# EAGLE design socket-v1 (EAGLE 6.2)
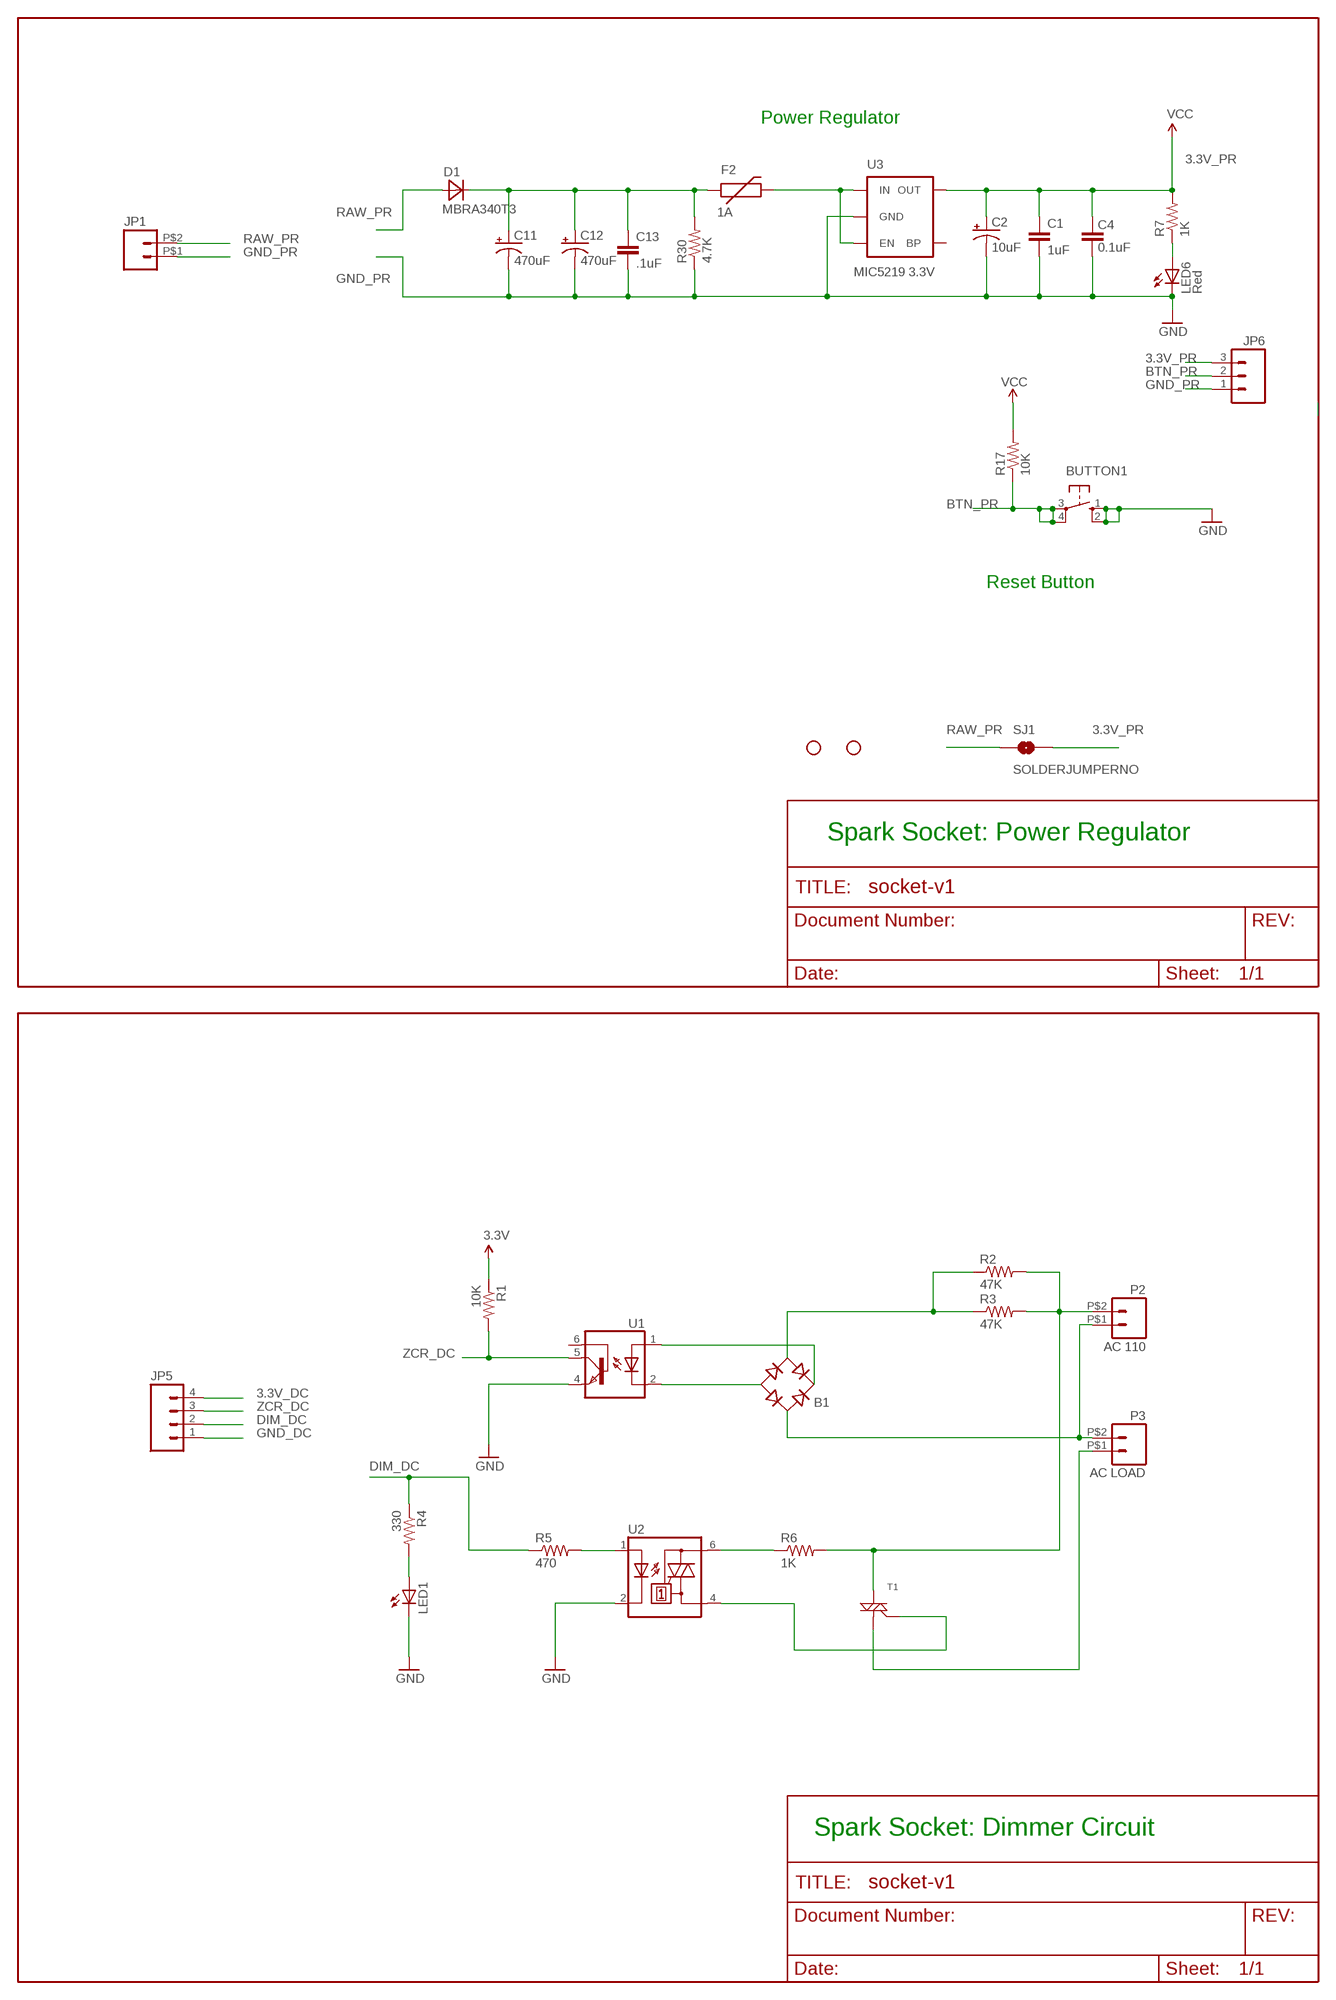
[diagram p0: schematic, sheet 1, part 1 of 2]
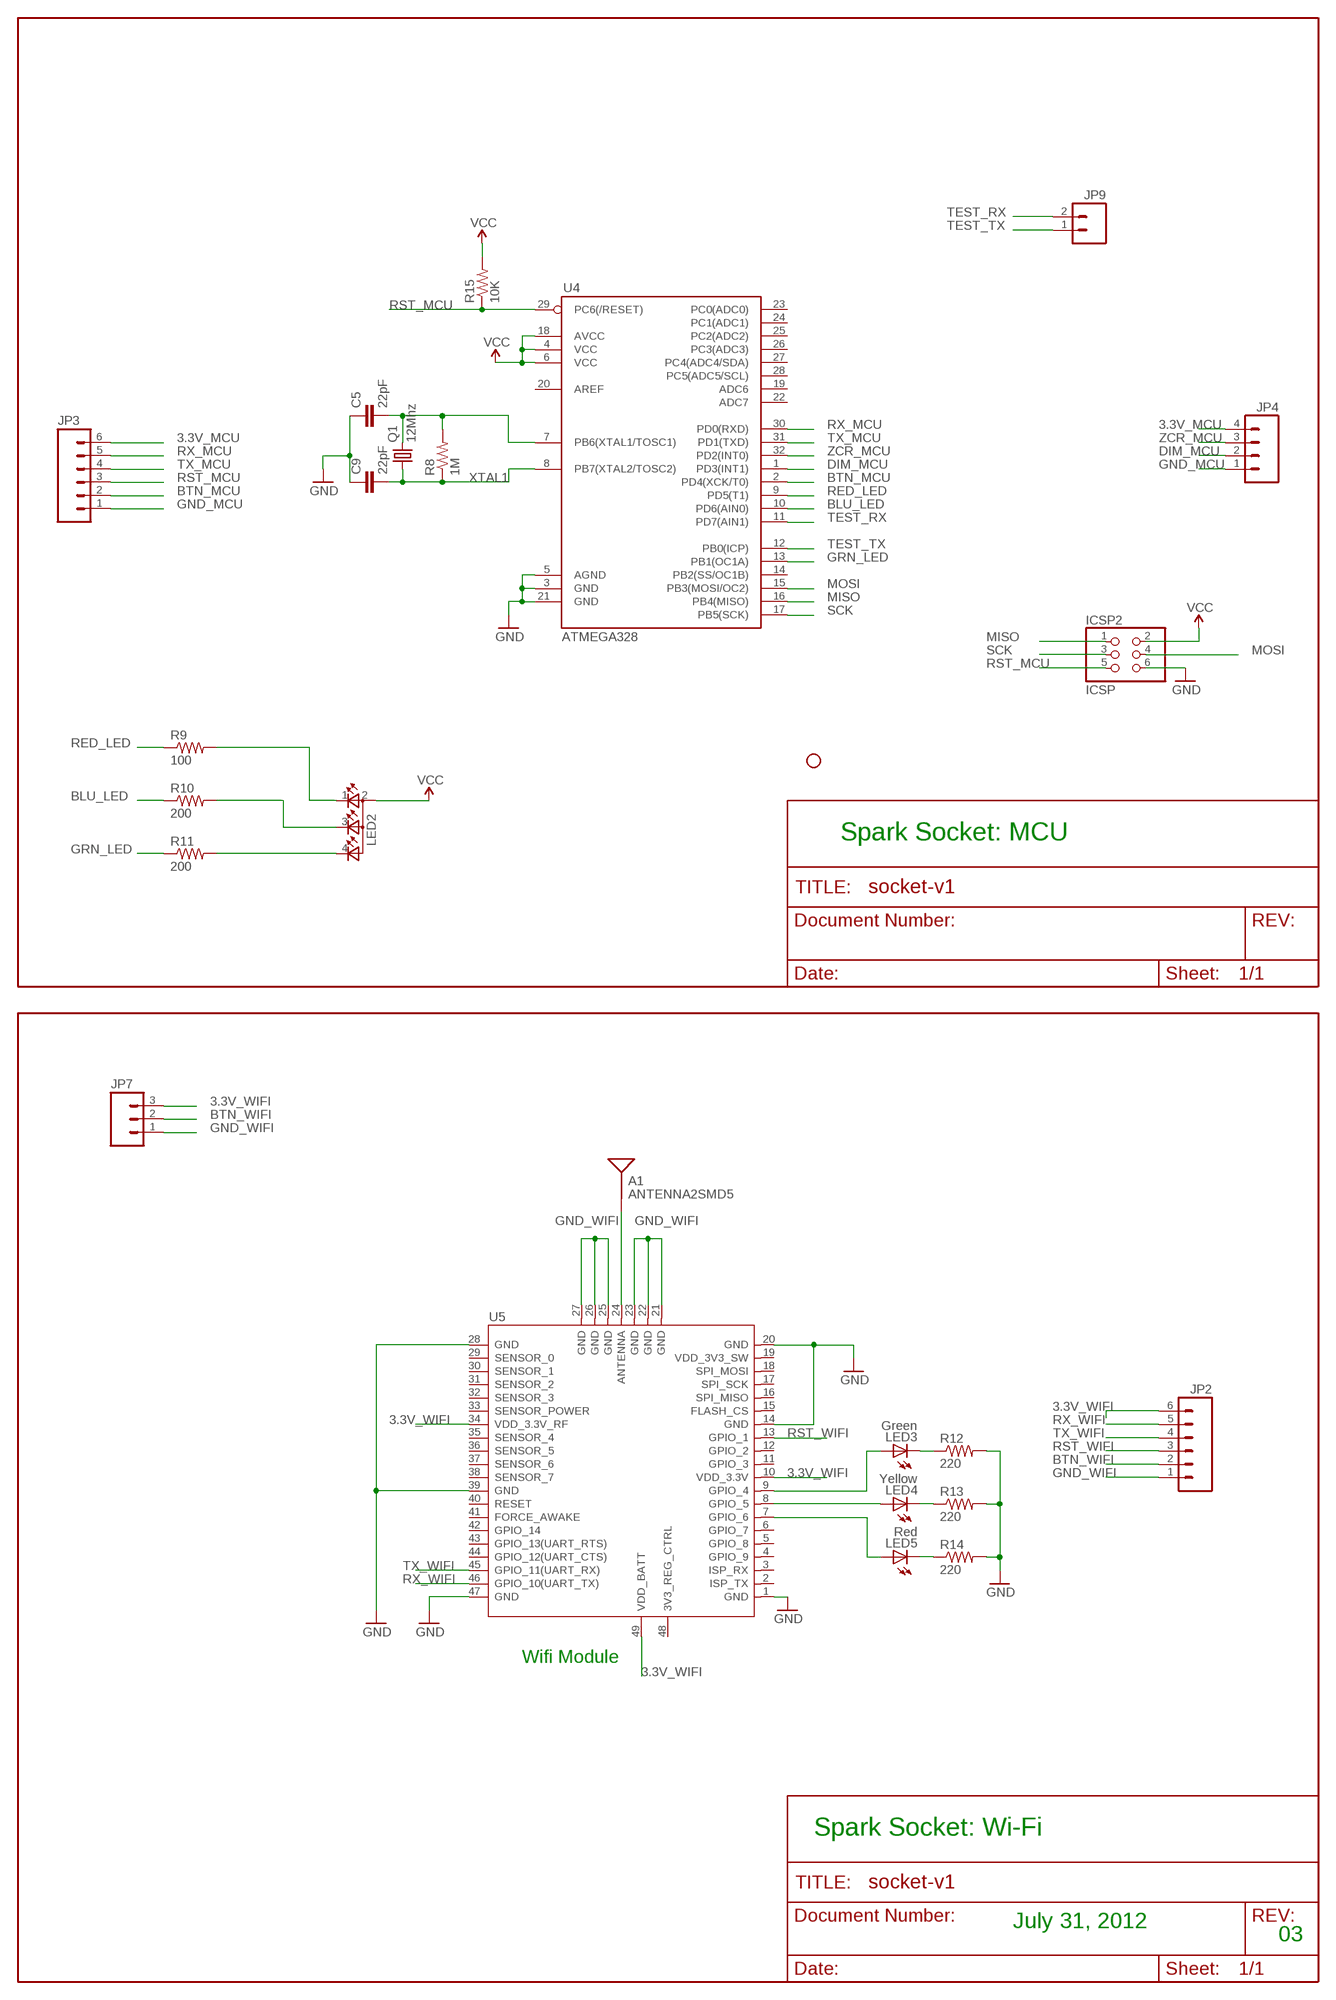
[diagram p1: schematic, sheet 1, part 2 of 2]

## Parts
A1  ANTENNA2SMD5  [ANTENNA-CHIP5]
B1  DF10S  [DFS]
BUTTON1  10-XX  [B3F-10XX]
C1  1uF  CAP0603-CAP  [0603-CAP]
C2  10uF  CAP_POL1206  [EIA3216]
C4  0.1uF  CAP0603-CAP  [0603-CAP]
C5  22pF  CAP0603-CAP  [0603-CAP]
C9  22pF  CAP0603-CAP  [0603-CAP]
C11  470uF  CAP_POL1206  [EIA3216]
C12  470uF  CAP_POL1206  [EIA3216]
C13  .1uF  CAP1206  [1206]
D1  MBRA340T3  [SMA]
F2  1A  PTCSMD  [PTC-1206]
ICSP2  ICSP  PINHD-2X3  [2X03]
JP1  M02PTH2  [1X02_BIG]
JP2  M06SIP  [1X06]
JP3  M06SIP  [1X06]
JP4  M04PTH  [1X04]
JP5  M04PTH  [1X04]
JP6  M03PTH  [1X03]
JP7  M03PTH  [1X03]
JP8  STAND-OFF  [STAND-OFF]
JP9  M02PTH  [1X02]
JP10  STAND-OFF  [STAND-OFF]
JP11  STAND-OFF  [STAND-OFF]
LED1  LED0603  [LED-0603]
LED2  TOPLED-3PLCC  [P-LCC-4-3]
LED3  Green  LED0603  [LED-0603]
LED4  Yellow  LED0603  [LED-0603]
LED5  Red  LED0603  [LED-0603]
LED6  Red  LED0603  [LED-0603]
P2  AC 110  M02PTH2  [1X02_BIG]
P3  AC LOAD  M02PTH2  [1X02_BIG]
Q1  12Mhz  CRYSTALHC49UP  [HC49UP]
R1  10K  RESISTOR0603-RES  [0603-RES]
R2  47K  RESISTOR1206  [1206]
R3  47K  RESISTOR1206  [1206]
R4  330  RESISTOR0603-RES  [0603-RES]
R5  470  RESISTOR0603-RES  [0603-RES]
R6  1K  RESISTOR1206  [1206]
R7  1K  RESISTOR0603-RES  [0603-RES]
R8  1M  RESISTOR0603-RES  [0603-RES]
R9  100  RESISTOR0603-RES  [0603-RES]
R10  200  RESISTOR0603-RES  [0603-RES]
R11  200  RESISTOR0603-RES  [0603-RES]
R12  220  RESISTOR0603-RES  [0603-RES]
R13  220  RESISTOR0603-RES  [0603-RES]
R14  220  RESISTOR0603-RES  [0603-RES]
R15  10K  RESISTOR0603-RES  [0603-RES]
R17  10K  RESISTOR0603-RES  [0603-RES]
R30  4.7K  RESISTOR0603-RES  [0603-RES]
SJ1  SOLDERJUMPERNO  [SJ_2S-NO]
T1  TRIACSMD  [SOT223]
U1  4N25SM  [DIL6-SMD]
U2  MOC3031S  [DIL6-SMD]
U3  MIC5219 3.3V  V_REG_LDOSMD  [SOT23-5]
U4  ATMEGA328  ATMEGA168  [TQFP32-08]
U5  WIFI-RN-171  [49P-1.27-26.67X17.78]

## Nets
3.3V_DC: JP5.4 R1.1 ; supply symbol labelled 3.3V
3.3V_MCU: ICSP2.2 JP3.6 JP4.4 LED2.2(A2) R15.2 U4.4(VCC) U4.6(VCC) U4.18(AVCC) ; supply symbol labelled VCC
3.3V_PR: C1.1 C2.A(+) C4.2 JP6.3 R7.2 R17.2 SJ1.2 U3.5(OUT) ; supply symbol labelled VCC
3.3V_WIFI: JP2.6 JP7.3 U5.10(VDD_3.3V) U5.34(VDD_3.3V_RF) U5.49(VDD_BATT)
ASDF: C11.A(+) C12.A(+) C13.1 D1.C F2.1 R30.2
BLU_LED: R10.1 U4.10(PD6(AIN0))
BTN_MCU: JP3.2 U4.2(PD4(XCK/T0))
BTN_PR: BUTTON1.3(P) BUTTON1.4(P1) JP6.2 R17.1
BTN_WIFI: JP2.2 JP7.2
DIM_DC: JP5.2 R4.1 R5.1
DIM_MCU: JP4.2 U4.1(PD3(INT1))
GND_DC: JP5.1 LED1.C U1.4(EMI) U2.2(C) ; supply symbol labelled GND
GND_MCU: C5.1 C9.1 ICSP2.6 JP3.1 JP4.1 U4.3(GND) U4.5(AGND) U4.21(GND) ; supply symbol labelled GND
GND_PR: BUTTON1.1(S) BUTTON1.2(S1) C1.2 C2.C(-) C4.1 C11.C(-) C12.C(-) C13.2 JP1.P$1 JP6.1 LED6.C R30.1 U3.2(GND) ; supply symbol labelled GND
GND_WIFI: JP2.1 JP7.1 R12.2 R13.2 R14.2 U5.1(GND) U5.14(GND) U5.20(GND) U5.21(GND) U5.22(GND) U5.23(GND) U5.25(GND) U5.26(GND) U5.27(GND) U5.28(GND) U5.39(GND) U5.47(GND) ; supply symbol labelled GND
GRN_LED: R11.1 U4.13(PB1(OC1A))
MISO: ICSP2.1 U4.16(PB4(MISO))
MOSI: ICSP2.4 U4.15(PB3(MOSI/OC2))
N$1: LED2.1(CRED) R9.2
N$2: LED6.A R7.1
N$3: F2.2 U3.1(IN) U3.3(EN)
N$4: B1.- U1.2(C)
N$5: B1.+ U1.1(A)
N$6: B1.AC2 R2.1 R3.1
N$7: P2.P$2 R2.2 R3.2 R6.2 T1.2(M2)
N$8: LED2.4(CGREEN) R11.2
N$9: R6.1 U2.6(A2)
N$10: T1.3(G) U2.4(A1)
N$11: P3.P$1 T1.1(M1)
N$12: B1.AC1 P2.P$1 P3.P$2
N$13: LED1.A R4.2
N$15: LED2.3(CBLUE) R10.2
N$16: R5.2 U2.1(A)
N$19: LED3.A U5.9(GPIO_4)
N$20: LED3.C R12.1
N$21: LED4.C R13.1
N$22: LED5.C R14.1
N$23: LED4.A U5.8(GPIO_5)
N$24: LED5.A U5.7(GPIO_6)
N$25: A1.FEED(SIGNAL) U5.24(ANTENNA)
N$38: C5.2 Q1.2 R8.2 U4.7(PB6(XTAL1/TOSC1))
RAW_PR: D1.A JP1.P$2 SJ1.1
RED_LED: R9.1 U4.9(PD5(T1))
RST_MCU: ICSP2.5 JP3.3 R15.1 U4.29(PC6(/RESET))
RST_WIFI: JP2.3 U5.13(GPIO_1)
RX_MCU: JP3.5 U4.30(PD0(RXD))
RX_WIFI: JP2.5 U5.46(GPIO_10(UART_TX))
SCK: ICSP2.3 U4.17(PB5(SCK))
TEST_RX: JP9.2 U4.11(PD7(AIN1))
TEST_TX: JP9.1 U4.12(PB0(ICP))
TX_MCU: JP3.4 U4.31(PD1(TXD))
TX_WIFI: JP2.4 U5.45(GPIO_11(UART_RX))
XTAL1: C9.2 Q1.1 R8.1 U4.8(PB7(XTAL2/TOSC2))
ZCR_DC: JP5.3 R1.2 U1.5(COL)
ZCR_MCU: JP4.3 U4.32(PD2(INT0))
Unconnected: U1.6(BAS) U3.4(BP) U4.14(PB2(SS/OC1B)) U4.19(ADC6) U4.20(AREF) U4.22(ADC7) U4.23(PC0(ADC0)) U4.24(PC1(ADC1)) U4.25(PC2(ADC2)) U4.26(PC3(ADC3)) U4.27(PC4(ADC4/SDA)) U4.28(PC5(ADC5/SCL)) U5.2(ISP_TX) U5.3(ISP_RX) U5.4(GPIO_9) U5.5(GPIO_8) U5.6(GPIO_7) U5.11(GPIO_3) U5.12(GPIO_2) U5.15(FLASH_CS) U5.16(SPI_MISO) U5.17(SPI_SCK) U5.18(SPI_MOSI) U5.19(VDD_3V3_SW) U5.29(SENSOR_0) U5.30(SENSOR_1) U5.31(SENSOR_2) U5.32(SENSOR_3) U5.33(SENSOR_POWER) U5.35(SENSOR_4) U5.36(SENSOR_5) U5.37(SENSOR_6) U5.38(SENSOR_7) U5.40(RESET) U5.41(FORCE_AWAKE) U5.42(GPIO_14) U5.43(GPIO_13(UART_RTS)) U5.44(GPIO_12(UART_CTS)) U5.48(3V3_REG_CTRL)

## Notes on the sheet
- Power Regulator
- Reset Button
- Spark Socket: Power Regulator | Spark Socket: MCU
- Wifi Module
- Spark Socket: Dimmer Circuit | Spark Socket: Wi-Fi
- July 31, 2012
- 03

## Library data of the parts
A1 = SparkFun:ANTENNA2: Antenna Single endded antenna. Common with smaller chip antennas. CHIP4 package is the GPS Chip Antenna SKU: GPS-08418. CHIP5 package is 2.4GHz chip antenna SKU: WRL-00144.
B1 = rectifier:DF*S: Surface Mount Glass Passivated Bridge Rectifiers Source: Source: Comchip Bridge Rectifiers DF005S-G thru DF10S-G.pdf
BUTTON1 = switch-omron:10-XX: OMRON SWITCH; MPN: B3F-1000; OC_FARNELL: 176432; OC_NEWARK: 36M3542
C1 C4 C5 C9 C13 = SparkFun:CAP: Capacitor Standard 0603 ceramic capacitor, and 0.1" leaded capacitor.
C2 C11 C12 = SparkFun:CAP_POL: Capacitor Polarized These are standard SMD and PTH capacitors. Normally 10uF, 47uF, and 100uF in electrolytic and tantalum varieties. Always verify the external diameter of the through hole cap, it varies with capacity, voltage, and manufacturer. The EIA devices should be standard.
D1 = diode:MBRA340T3: Surface Mount Schottky Power Rectifier Source: http://www.onsemi.com/pub_link/Collateral/MBRA340T3-D.PDF
F2 = SparkFun:PTC: Resettable Fuse PTC Resettable Fuse. Spark Fun Electronics SKU : COM-08357
ICSP2 = pinhead:PINHD-2X3: PIN HEADER
JP1 JP9 P2 P3 = SparkFun:M02: Header 2 Standard 2-pin 0.1" header. Use with straight break away headers (SKU : PRT-00116), right angle break away headers (PRT-00553), swiss pins (PRT-00743), machine pins (PRT-00117), and female headers (PRT-00115). Molex polarized connector foot print use with SKU : PRT-08233 with associated crimp pins and housings.
JP2 JP3 = SparkFun:M06: Header 6 Standard 6-pin 0.1" header. Use with straight break away headers (SKU : PRT-00116), right angle break away headers (PRT-00553), swiss pins (PRT-00743), machine pins (PRT-00117), and female headers (PRT-00115). Molex polarized connector foot print use with SKU : PRT-08094 with associated crimp pins and housings. NOTES ON THE VARIANTS LOCK and LOCK_LONGPADS... This footprint was designed to help hold the alignment of a through-hole component (i.e. 6-pin header) while soldering it into place. You may notice that each hole has been shifted either up or down by 0.005 of an inch from it's more standard position (which is a perfectly straight line). This slight alteration caused the pins (the squares in the middle) to touch the edges of the holes. Because they are alternating, it causes a "brace" to hold the component in place. 0.005 has proven to be the perfect amount of "off-center" position when using our standard breakaway headers. Although looks a little odd when you look at the bare footprint, once you have a header in there, the alteration is very hard to notice. Also, if you push a header all the way into place, it is covered up entirely on the bottom side. This idea of altering the position of holes to aid alignment will be further integrated into the Sparkfun Library for other footprints. It can help hold any component with 3 or more connection pins.
JP4 JP5 = SparkFun:M04: Header 4 Standard 4-pin 0.1" header. Use with straight break away headers (SKU : PRT-00116), right angle break away headers (PRT-00553), swiss pins (PRT-00743), machine pins (PRT-00117), and female headers (PRT-00115). Molex polarized connector foot print use with SKU : PRT-08231 with associated crimp pins and housings. 1MM SMD Version SKU: PRT-10208
JP6 JP7 = SparkFun:M03: Header 3 Standard 3-pin 0.1" header. Use with straight break away headers (SKU : PRT-00116), right angle break away headers (PRT-00553), swiss pins (PRT-00743), machine pins (PRT-00117), and female headers (PRT-00115). Molex polarized connector foot print use with SKU : PRT-08232 with associated crimp pins and housings.
JP8 JP10 JP11 = SparkFun:STAND-OFF: Stand Off This is the mechanical footprint for a #4 phillips button head screw. Use the keepout ring to avoid running the screw head into surrounding components. SKU : PRT-00447
LED1 LED3-LED6 = SparkFun:LED: LEDs Standard schematic elements and footprints for 5mm, 3mm, 1206, and 0603 sized LEDs. 5mm - Spark Fun Electronics SKU : COM-00529 (and others)
LED2 = Spark:TOPLED-3: Cree CLVBA-FKA
Q1 = crystal:CRYSTAL: CRYSTAL; OC_FARNELL: unknown; OC_NEWARK: unknown
R1-R15 R17 R30 = SparkFun:RESISTOR: Resistor Basic schematic elements and footprints for 0603, 1206, and PTH resistors.
SJ1 = SparkFun:SOLDERJUMPER: Solder Jumper Standard SMD solder jumper. Used to automate production. Two varients : Normally Open and Normally Closed are the same, but have different paste layers. NC will have a large amount of paste and should jumper during reflow.
T1 = SparkFun:TRIAC
U1 = optocoupler:4N*?M: General Purpose 6-Pin Phototransistor Optocouplers Source: http://www.fairchildsemi.com/ds/4N/4N35-M.pdf; MF: FAIRCHILD SEMICONDUCTOR; MPN: 4N25SM; OC_FARNELL: 1021152; OC_NEWARK: 34C2020
U2 = optocoupler:MOC30*: 6-Pin DIP Zero-Cross Optoisolators Triac Driver Output (250/400 Volt Peak) Source: http://www.fairchildsemi.com/ds/MO/MOC3043-M.pdf; MF: FAIRCHILD SEMICONDUCTOR; MPN: MOC3031SM; OC_FARNELL: unknown; OC_NEWARK: 34C1335
U3 = SparkFun:V_REG_LDO: Voltage Regulator LDO Standard 150mA LDO voltage regulator in SOT-23 layout. Micrel part MIC5205. BP (by-pass) pin is used to lower output noise with 470pF cap.
U4 = SparkFun:ATMEGA168
U5 = Module:WIFI-RN-171: WIFLY GSX 802.11 b/g wireless LAN Module

## Net classes
2 gnd: width 0.203 mm, drill 0.559 mm, clearance 0.152 mm
3 usbvcc: width 0.203 mm, drill 0.61 mm, clearance 0.152 mm
4 aref: width 0.203 mm, drill 0.61 mm, clearance 0.152 mm

## Board
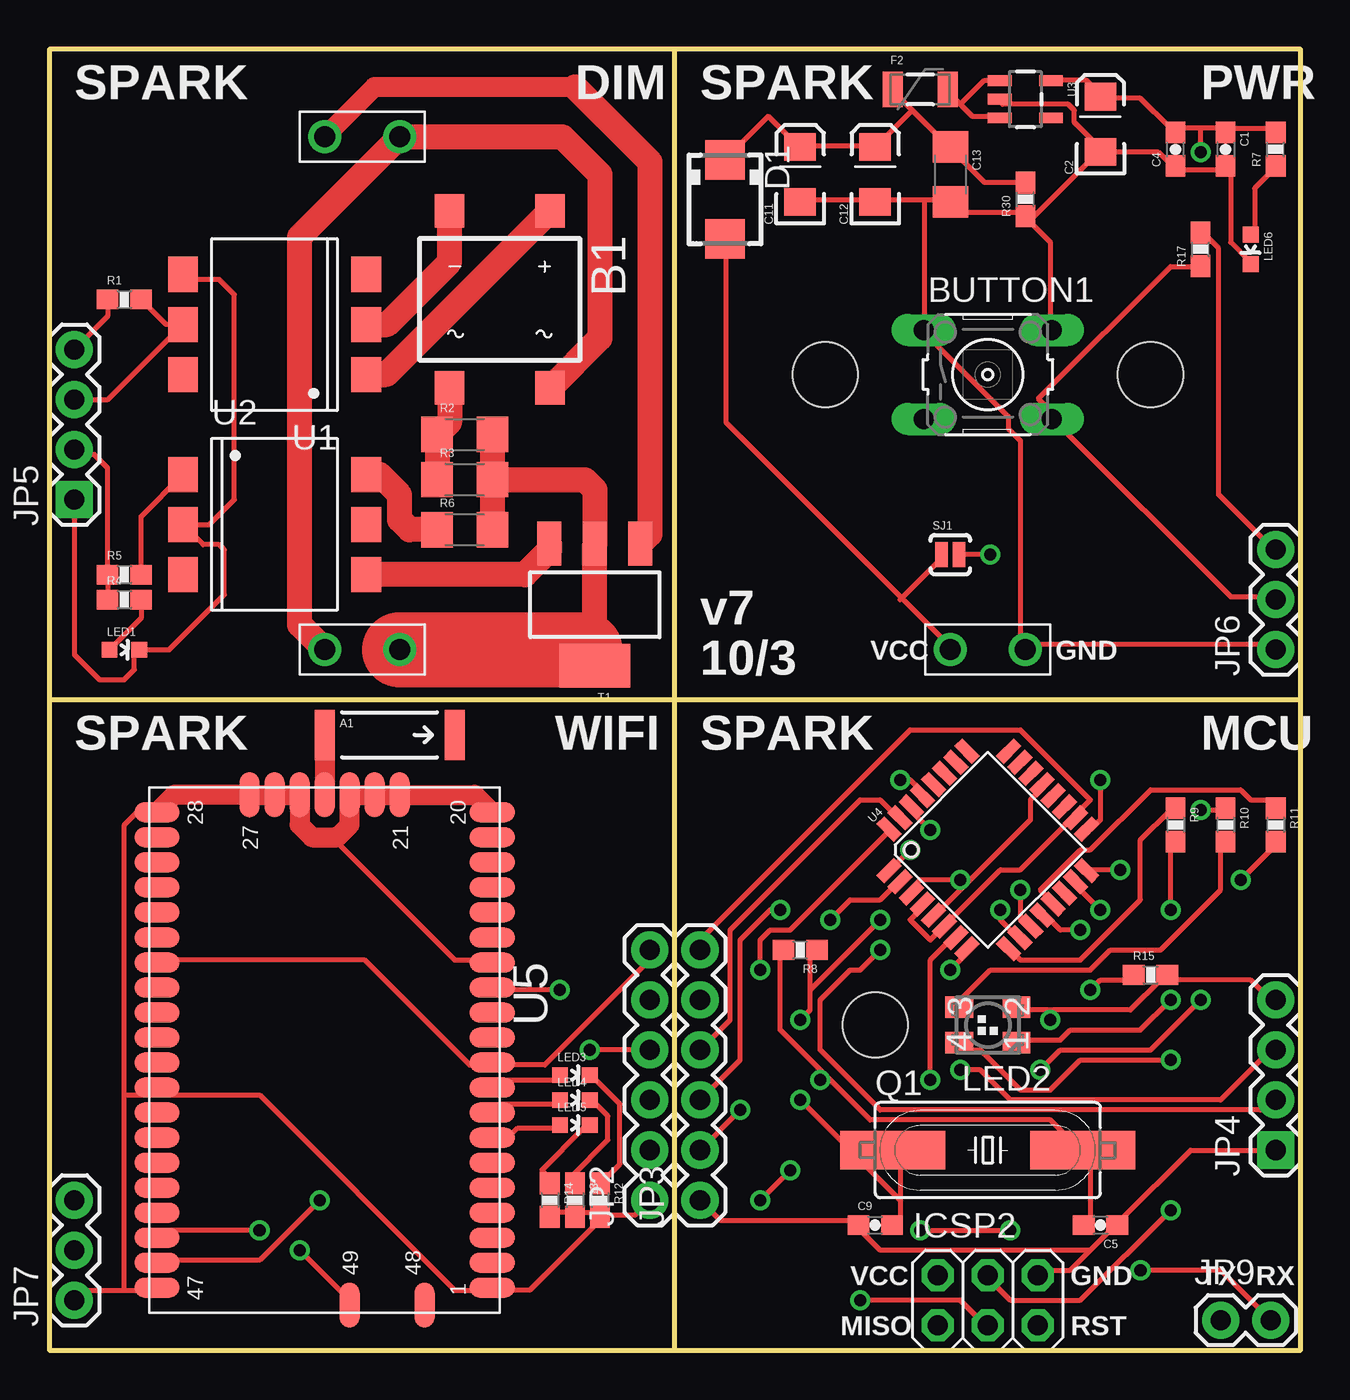
[diagram p2: board, top side]
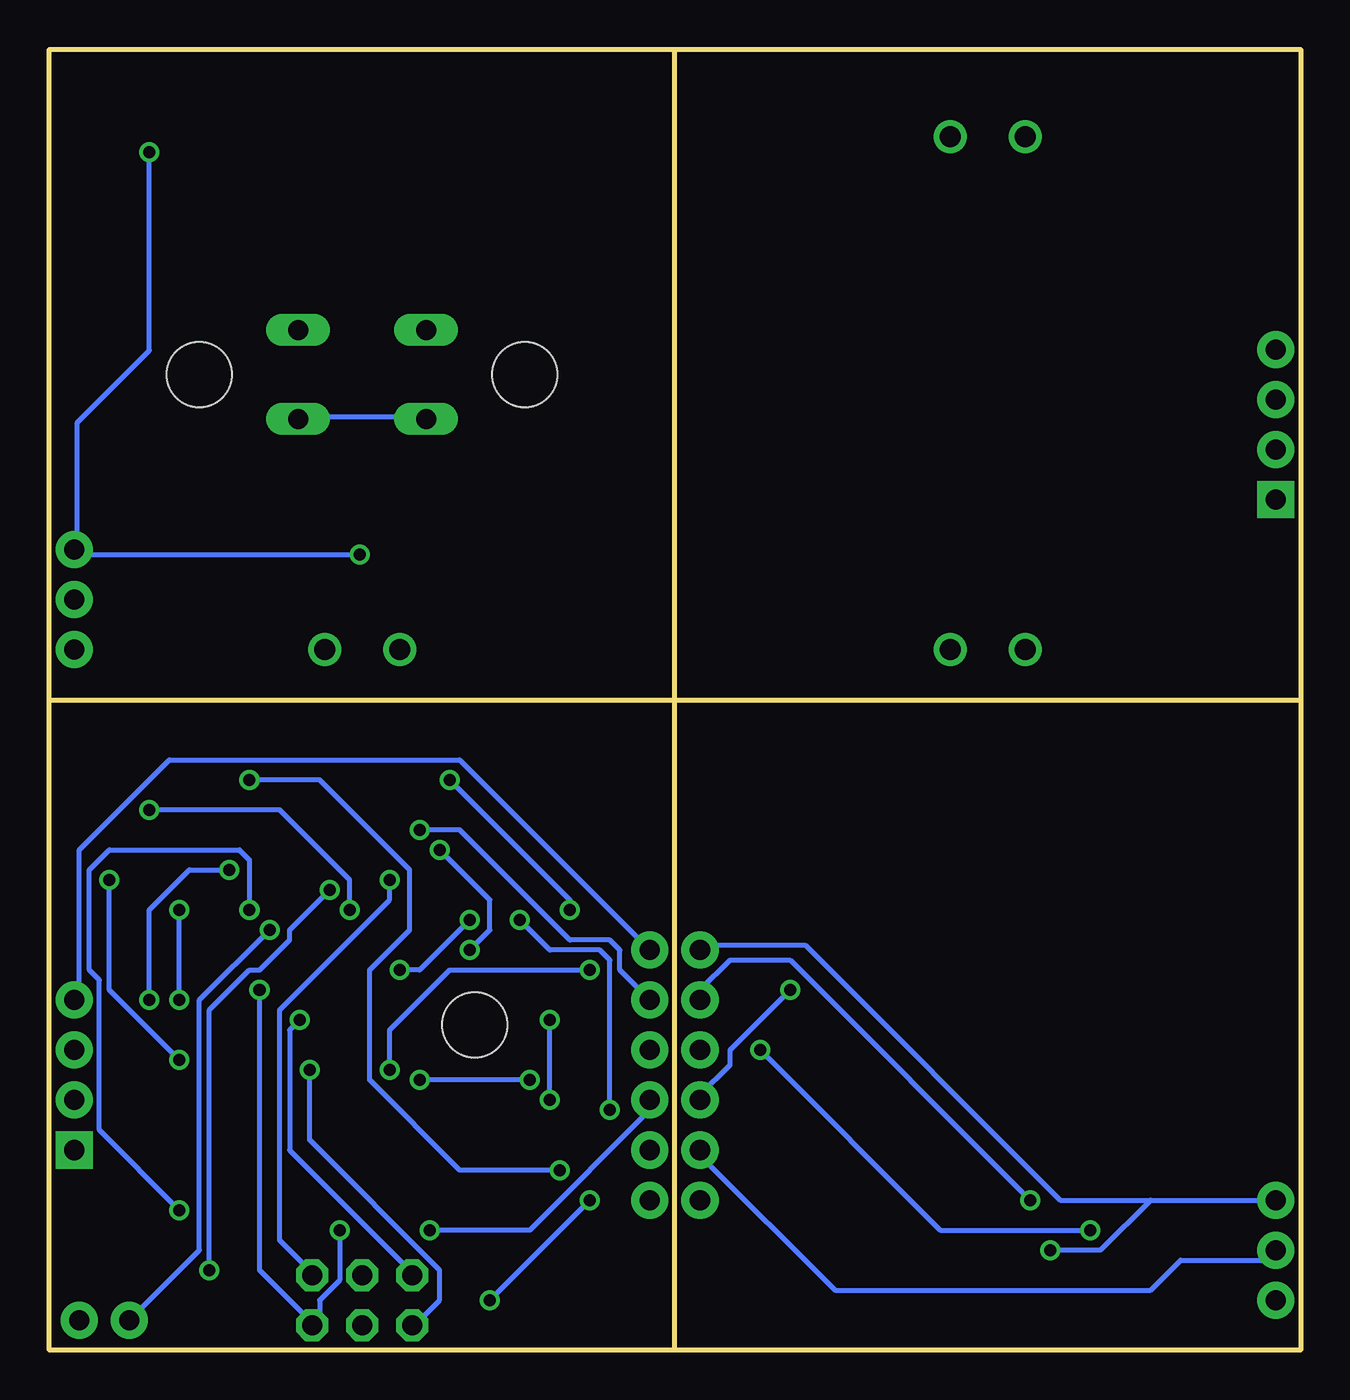
[diagram p3: board, bottom side, seen from below]

Size 63.5 x 66.04 mm. Coordinates in mm from the lower left corner, seen from the top.
Outline: 31.75,0 0,0 0,33.02
Outline: 31.75,0 31.75,33.02
Outline: 31.75,33.02 0,33.02
Outline: 31.75,0 63.5,0 63.5,33.02
Outline: 63.5,33.02 31.75,33.02
Outline: 63.5,33.02 63.5,66.04 31.75,66.04
Outline: 31.75,33.02 31.75,66.04
Outline: 31.75,66.04 0,66.04 0,33.02
Copper layers (1*16): Top 0.035mm / dielectric 1.5mm / Bottom 0.035mm
Design rules: minimum track width 10mil, minimum drill 24mil, track to track 8mil, track to pad 8mil, pad to pad 8mil, via to via 8mil, smd to smd 8mil, copper to edge 40mil, drill to drill 8mil, minimum pad ring 12mil, minimum via ring 8mil, stop-mask expansion 4mil, vias tented up to drill 0mil, thermal gap 10mil

### Footprints (pad centres in the part's own frame; a part is rotated, then mirrored left to right if it is on the bottom)
ANTENNA-CHIP5 = smd 1.016 x 2.54: FEED -3.302,0; NC 3.302,0
DFS = smd 1.5 x 1.7: + -2.55,-4.5; - 2.55,-4.5; AC1 -2.55,4.5; AC2 2.55,4.5
B3F-10XX = drill 1.016 long: 1 -3.251,2.261; 2 3.251,2.261; 3 -3.251,-2.261; 4 3.251,-2.261
0603-CAP = smd 1.1 x 1: 1 -0.85,0; 2 0.85,0
EIA3216 = smd 1.4 x 1.6: A 1.4,0; C -1.4,0
1206 = smd 1.6 x 1.8: 1 -1.4,0; 2 1.4,0
SMA = smd 2 x 2: A 2,0; C -2,0
PTC-1206 = smd 1 x 1.8: 1 -1.4,0; 2 1.4,0
2X03 = drill 1.016 octagon: 1 -2.54,-1.27; 2 -2.54,1.27; 3 0,-1.27; 4 0,1.27; 5 2.54,-1.27; 6 2.54,1.27
1X02_BIG = drill 1.067: P$1 0,0; P$2 3.81,0
1X06 = drill 1.016 pad 1.88: 1 0,0; 2 2.54,0; 3 5.08,0; 4 7.62,0; 5 10.16,0; 6 12.7,0
1X04 = drill 1.016 pad 1.88 square: 1 0,0 | drill 1.016 pad 1.88: 2 2.54,0; 3 5.08,0; 4 7.62,0
1X03 = drill 1.016 pad 1.88: 1 0,0; 2 2.54,0; 3 5.08,0
STAND-OFF = hole 3.302: 0,0
1X02 = drill 1.016 pad 1.88: 1 0,0; 2 2.54,0
LED-0603 = smd 0.8 x 0.8: A 0,-0.75; C 0,0.75
P-LCC-4-3 = smd 1.1 x 1.4: 1 -0.9,-1.45; 2 0.9,-1.45; 3 0.9,1.45; 4 -0.9,1.45
HC49UP = smd 5.334 x 1.93: 1 -4.826,0; 2 4.826,0
0603-RES = smd 1.1 x 1: 1 -0.85,0; 2 0.85,0
SJ_2S-NO = smd 0.635 x 1.27: 1 -0.45,0; 2 0.45,0
SOT223 = smd 1.219 x 2.235: 1 -2.311,-3.099; 2 0,-3.099; 3 2.311,-3.099 | smd 3.6 x 2.2: 4 0,3.099
DIL6-SMD = smd 1.78 x 1.52: 1 -2.54,-4.645; 2 0,-4.645; 3 2.54,-4.645; 4 2.54,4.645; 5 0,4.645; 6 -2.54,4.645
SOT23-5 = smd 0.55 x 1.2: 1 -0.95,-1.3; 2 0,-1.3; 3 0.95,-1.3; 4 0.95,1.3; 5 -0.95,1.3
TQFP32-08 = smd 1.27 x 0.559: 1 -4.293,2.8; 2 -4.293,2; 3 -4.293,1.2; 4 -4.293,0.4; 5 -4.293,-0.4; 6 -4.293,-1.2; 7 -4.293,-2; 8 -4.293,-2.8; 17 4.293,-2.8; 18 4.293,-2; 19 4.293,-1.2; 20 4.293,-0.4; 21 4.293,0.4; 22 4.293,1.2; 23 4.293,2; 24 4.293,2.8 | smd 0.559 x 1.27: 9 -2.8,-4.293; 10 -2,-4.293; 11 -1.2,-4.293; 12 -0.4,-4.293; 13 0.4,-4.293; 14 1.2,-4.293; 15 2,-4.293; 16 2.8,-4.293; 25 2.8,4.293; 26 2,4.293; 27 1.2,4.293; 28 0.4,4.293; 29 -0.4,4.293; 30 -1.2,4.293; 31 -2,4.293; 32 -2.8,4.293
49P-1.27-26.67X17.78 = smd 1.016 x 2.286: 1 12.065,8.509; 2 10.795,8.509; 3 9.525,8.509; 4 8.255,8.509; 5 6.985,8.509; 6 5.715,8.509; 7 4.445,8.509; 8 3.175,8.509; 9 1.905,8.509; 10 0.635,8.509; 11 -0.635,8.509; 12 -1.905,8.509; 13 -3.175,8.509; 14 -4.445,8.509; 15 -5.715,8.509; 16 -6.985,8.509; 17 -8.255,8.509; 18 -9.525,8.509; 19 -10.795,8.509; 20 -12.065,8.509; 28 -12.065,-8.509; 29 -10.795,-8.509; 30 -9.525,-8.509; 31 -8.255,-8.509; 32 -6.985,-8.509; 33 -5.715,-8.509; 34 -4.445,-8.509; 35 -3.175,-8.509; 36 -1.905,-8.509; 37 -0.635,-8.509; 38 0.635,-8.509; 39 1.905,-8.509; 40 3.175,-8.509; 41 4.445,-8.509; 42 5.715,-8.509; 43 6.985,-8.509; 44 8.255,-8.509; 45 9.525,-8.509; 46 10.795,-8.509; 47 12.065,-8.509 | smd 2.286 x 1.016: 21 -12.954,3.81; 22 -12.954,2.54; 23 -12.954,1.27; 24 -12.954,0; 25 -12.954,-1.27; 26 -12.954,-2.54; 27 -12.954,-3.81; 48 12.954,5.08; 49 12.954,1.27

### Placement (x,y rotation side)
A1  17.27,31.24 0 top
B1  22.86,53.34 180 top
BUTTON1  47.62,49.53 0 top
C1  59.69,60.96 270 top
C2  53.34,62.23 90 top
C4  57.15,60.96 90 top
C5  53.34,6.35 180 top
C9  41.91,6.35 0 top
C11  38.1,59.69 90 top
C12  41.91,59.69 90 top
C13  45.72,59.69 270 top
D1  34.29,58.42 270 top
F2  44.2,64.01 0 top
ICSP2  47.62,2.54 0 top
JP1  49.53,35.56 180 top
JP2  30.48,7.62 90 top
JP3  33.02,7.62 90 top
JP4  62.23,10.16 90 top
JP5  1.27,43.18 90 top
JP6  62.23,35.56 90 top
JP7  1.27,2.54 90 top
JP8  41.91,16.51 0 top
JP9  59.44,1.52 0 top
JP10  39.37,49.53 0 top
JP11  55.88,49.53 0 top
LED1  3.81,35.56 270 top
LED2  47.62,16.51 90 top
LED3  26.67,13.97 270 top
LED4  26.67,12.7 270 top
LED5  26.67,11.43 270 top
LED6  60.96,55.88 180 top
P2  13.97,35.56 0 top
P3  13.97,61.59 0 top
Q1  47.62,10.16 0 top
R1  3.81,53.34 0 top
R2  21.08,46.48 0 top
R3  21.08,44.2 0 top
R4  3.81,38.1 0 top
R5  3.81,39.37 0 top
R6  21.08,41.66 0 top
R7  62.23,60.96 90 top
R8  38.1,20.32 180 top
R9  57.15,26.67 270 top
R10  59.69,26.67 270 top
R11  62.23,26.67 270 top
R12  27.94,7.62 270 top
R13  26.67,7.62 270 top
R14  25.4,7.62 270 top
R15  55.88,19.05 0 top
R17  58.42,55.88 90 top
R30  49.53,58.42 90 top
SJ1  45.72,40.39 0 top
T1  27.69,37.85 180 top
U1  11.43,52.07 90 top
U2  11.43,41.91 270 top
U3  49.53,63.5 270 top
U4  47.62,25.4 45 top
U5  13.97,15.24 270 top

### Tracks (layer width: path | path; a pad name or v marks a point on that pad's centre or on a via)
3.3V_DC
  Top 0.254: R1.1 2.96,52.49 JP5.4
3.3V_MCU  (via drill 0.61)
  Top 0.254: U4.4 44.2,22.35 43.69,21.84 44.7,20.83 45.21,21.34 U4.6 45.72,21.84 48.26,24.38 49.28,24.38 51.82,26.92 U4.18 52.32,27.43 52.83,27.94 49.28,31.5 43.69,31.5 33.02,20.83 JP3.6 | JP4.4 61.98,17.78 60.96,18.8 56.9,18.8 R15.2 56.39,18.8 54.86,17.27 50.8,17.27 | 50.8,17.27 49.28,17.27 LED2.2 | 50.8,17.27 v50.8,16.76
  Bottom 0.254: v50.8,16.76 51.31,16.26 51.31,10.16 45.21,4.06 ICSP2.2 | JP3.6 42.67,29.97 57.4,29.97 61.98,25.4 61.98,17.78 JP4.4
3.3V_PR  (via drill 0.61)
  Top 0.254: U3.5 51.1,64.47 52.63,64.47 53.24,63.86 C2.A 53.54,63.55 55.37,63.55 56.9,62.03 C4.2 57.2,62.03 58.42,62.03 | 58.42,62.03 59.64,62.03 C1.1 59.94,62.03 62.08,62.03 R7.2 | R17.2 58.42,56.54 58.73,56.54 59.33,55.93 59.33,43.43 62.08,40.69 JP6.3 | v58.42,60.81 58.42,62.03 | v47.75,40.39 SJ1.2
  Bottom 0.254: v58.42,60.81 58.42,50.75 62.08,47.09 62.08,40.69 JP6.3 62.23,40.39 v47.75,40.39
3.3V_WIFI  (via drill 0.61)
  Top 0.254: JP2.6 30.48,19.81 25.15,14.48 22.86,14.48 U5.10 22.1,14.48 21.34,14.48 16,19.81 6.1,19.81 U5.34 | v12.7,5.08 15.24,2.54 U5.49
  Bottom 0.254: 7.62,7.62 12.19,7.62 25.15,20.57 30.48,20.57 JP2.6 | 7.62,7.62 JP7.3 | v12.7,5.08 10.16,5.08 7.62,7.62
ASDF
  Top 0.254: D1.C 34.34,60.5 36.47,62.64 38,61.11 C11.A 38.3,61.11 41.66,61.11 C12.A 41.96,61.11 43.79,62.94 | R30.2 49.28,59.28 47.45,59.28 45.92,60.81 C13.1 45.62,61.11 43.79,62.94 | 43.79,62.94 42.88,63.86 F2.1
BLU_LED  (via drill 0.61)
  Top 0.254: v58.42,27.43 59.44,27.43 R10.1 | v48.26,22.35 48.26,21.84 48.77,21.34 U4.10
  Bottom 0.254: v58.42,27.43 51.82,27.43 48.26,23.88 v48.26,22.35
BTN_MCU  (via drill 0.61)
  Top 0.254: v39.62,21.84 40.64,22.86 42.16,22.86 43.18,23.88 U4.2 | JP3.2 v35.05,12.19
  Bottom 0.254: v39.62,21.84 38.1,20.32 35.56,20.32 35.05,19.81 v35.05,12.19
BTN_PR
  Top 0.254: JP6.2 62.08,38.25 59.94,38.25 51.1,47.09 BUTTON1.4 51.1,47.4 50.19,48.31 56.9,55.02 58.42,55.02 R17.1
  Bottom 0.254: BUTTON1.3 44.4,47.4 50.8,47.4 BUTTON1.4
BTN_WIFI
  Bottom 0.254: JP7.2 1.52,4.57 6.1,4.57 7.62,3.05 23.62,3.05 30.48,9.91 JP2.2
DIM_DC
  Top 0.254: R4.1 R5.1 2.96,44.79 2.29,45.47 1.52,45.47 JP5.2
DIM_MCU  (via drill 0.61)
  Top 0.254: v43.69,25.4 42.67,24.38 U4.1 | v42.16,20.32 41.15,19.3 40.64,19.3 39.12,17.78 39.12,15.24 42.16,12.19 61.47,12.19 61.98,12.7 JP4.2
  Bottom 0.254: v43.69,25.4 41.15,22.86 41.15,21.34 v42.16,20.32
GND_DC
  Top 0.254: U1.4 7.04,54.36 8.64,54.36 9.4,53.59 9.4,43.18 8.13,41.91 U2.2 7.8,40.89 8.64,40.89 8.89,40.64 8.89,38.35 6.1,35.56 LED1.C 4.32,35.32 4.32,34.54 3.81,34.04 2.54,34.04 1.27,35.31 JP5.1
GND_MCU  (via drill 0.61)
  Top 0.254: JP3.1 34.04,6.6 40.64,6.6 C9.1 41.15,6.1 42.16,5.08 52.83,5.08 | 46.74,23.88 49.78,26.92 49.78,27.94 50.29,28.45 U4.21 | 46.74,23.88 45.21,22.35 U4.5 | 46.74,23.88 v46.23,23.88 44.2,23.88 43.69,23.37 U4.3 | 52.83,5.08 51.82,4.06 50.29,4.06 ICSP2.6 | 52.83,5.08 53.85,6.1 C5.1 54.36,6.6 57.91,10.16 JP4.1
  Bottom 0.254: v46.23,23.88 46.23,22.86 51.82,17.27 51.82,5.59 50.29,4.06 ICSP2.6
GND_PR
  Top 0.254: JP6.1 62.08,35.81 49.58,35.81 JP1.P$1 49.28,35.81 49.28,46.18 48.67,46.79 48.67,47.4 44.4,51.66 BUTTON1.1 44.4,51.97 44.4,58.37 | C11.C 38.3,58.37 41.66,58.37 C12.C 41.96,58.37 44.4,58.37 | R30.1 49.28,57.76 46.23,57.76 45.92,58.06 C13.2 45.62,58.37 44.4,58.37 | BUTTON1.2 50.8,51.97 50.8,56.24 49.58,57.45 R30.1 | U3.2 48.36,63.25 51.71,63.25 52.02,62.94 52.02,62.33 53.24,61.11 C2.C | LED6.C 60.86,55.32 59.94,56.24 59.94,59.89 C1.2 59.64,59.89 57.2,59.89 C4.1 56.9,60.2 56.29,60.81 53.54,60.81 C2.C | C2.C 53.24,60.81 49.89,57.45 49.58,57.76 R30.1
GND_WIFI
  Top 0.254: R14.2 25.6,7.01 26.52,7.01 R13.2 26.82,7.01 27.74,7.01 R12.2 28.19,6.86 | 22.1,19.81 22.25,19.81 U5.14 22.1,19.81 | 28.19,6.86 29.72,6.86 JP2.1 | 28.19,6.86 24.38,3.05 22.86,3.05 U5.1 22.1,3.05 20.57,3.05 10.67,12.95 6.1,12.95 U5.39 5.33,12.95 3.81,12.95 | 22.1,19.81 20.57,19.81 14.48,25.91 14.48,26.04 | 3.81,3.05 1.52,3.05 JP7.1 | 3.81,3.05 5.33,3.05 U5.47 | 3.81,3.05 3.81,12.95 | 3.81,12.95 3.81,26.67 4.57,27.43 5.33,27.43 U5.28
  Top 1.016: U5.20 21.59,28.19 U5.21 U5.22 U5.23 15.24,26.67 14.61,26.04 14.48,26.04 13.34,26.04 12.7,26.67 U5.25 U5.26 U5.27 6.35,28.19 U5.28
GRN_LED
  Top 0.254: R11.1 61.98,27.94 60.96,27.94 60.45,28.45 55.88,28.45 52.83,25.4 52.32,25.4 50.29,23.37 50.8,22.86 U4.13
MISO  (via drill 0.61)
  Top 0.254: v54.36,24.38 52.83,24.38 U4.16 | v58.42,17.78 55.88,15.24 51.31,15.24 v50.29,14.22
  Bottom 0.254: v54.36,24.38 56.39,24.38 58.42,22.35 v58.42,17.78 | v50.29,14.22 50.29,10.67 43.69,4.06 43.69,2.54 44.7,1.52 ICSP2.1
MOSI  (via drill 0.61)
  Top 0.254: v53.34,22.35 52.32,23.37 U4.15 | v56.9,7.11 52.32,2.54 48.77,2.54 47.75,3.56 ICSP2.4
  Bottom 0.254: v53.34,22.35 53.34,24.89 53.85,25.4 60.45,25.4 61.47,24.38 61.47,19.3 60.96,18.8 60.96,11.18 v56.9,7.11
N$1  (via drill 0.61)
  Top 0.254: v56.9,22.35 56.9,25.4 R9.2 | v56.9,17.78 55.37,16.26 51.82,16.26 51.31,15.75 49.28,15.75 LED2.1
  Bottom 0.254: v56.9,17.78 v56.9,22.35
N$2
  Top 0.254: LED6.A 61.16,56.84 61.16,58.98 62.08,59.89 R7.1
N$3
  Top 0.254: 46.23,63.25 45.62,63.86 F2.2 | 46.23,63.25 46.84,62.64 48.06,62.64 U3.3 | 46.23,63.25 47.45,64.47 48.06,64.47 U3.1
N$4
  Top 1.27: U1.2 17.14,52.07 20.32,55.24 B1.-
N$5
  Top 1.27: U1.1 17.1,49.53 B1.+
N$6
  Top 1.27: B1.AC2 20.31,47.11 R2.1 R3.1
N$7
  Top 1.27: R2.2 R3.2 | R3.2 27.18,44.2 27.69,43.69 T1.2 27.69,36.07 27.18,35.56 | R3.2 R6.2
  Top 3.81: P2.P$2 27.18,35.56
N$8  (via drill 0.61)
  Top 0.254: v60.45,23.88 61.98,25.4 R11.2 | v56.9,14.73 52.32,14.73 50.8,13.21 49.28,13.21 47.24,15.24 46.23,15.24 LED2.4
  Bottom 0.254: v60.45,23.88 60.45,18.29 v56.9,14.73
N$9
  Top 1.27: R6.1 18.29,41.66 17.78,42.16 17.78,43.43 16.76,44.45 U2.6
N$10
  Top 1.27: T1.3 25.38,40.62 24.13,39.37 U2.4
N$11
  Top 1.016: P3.P$1 16.51,64.14 26.67,64.14
  Top 1.27: 26.67,64.14 30.48,60.33 30.48,41.43 T1.1
N$12
  Top 1.27: P2.P$1 12.7,36.83 12.7,56.52 P3.P$2 26.04,61.59 27.94,59.69 27.94,51.37 B1.AC1
N$13
  Top 0.254: R4.2 4.66,37.16 LED1.A
N$15
  Top 0.254: R10.2 59.44,25.4 59.44,23.37 56.39,20.32 53.85,20.32 52.83,19.3 47.75,19.3 46.23,17.78 LED2.3
N$16
  Top 0.254: R5.2 4.66,42.33 U2.1
N$19
  Top 0.254: U5.9 22.86,13.72 25.91,13.72 LED3.A
N$20
  Top 0.254: LED3.C 27.43,13.72 27.74,13.72 28.96,12.5 28.96,9.45 28.04,8.53 R12.1
N$21
  Top 0.254: LED4.C 27.43,12.5 27.74,12.5 28.35,11.89 28.35,10.67 26.52,8.84 26.82,8.53 R13.1
N$22
  Top 0.254: LED5.C 27.13,11.28 24.99,9.14 25.6,8.53 R14.1
N$23
  Top 0.254: LED4.A 25.91,12.5 22.86,12.5 22.55,12.19 U5.8
N$24
  Top 0.254: LED5.A 25.91,11.28 23.77,11.28 22.86,10.36 22.55,10.67 U5.7
N$25
  Top 1.016: A1.FEED U5.24
N$38  (via drill 0.61)
  Top 0.254: C5.2 52.83,6.6 52.83,10.16 Q1.2 52.32,10.16 50.8,11.68 41.66,11.68 39.12,14.22 | 39.12,14.22 37.08,16.26 37.08,20.32 R8.2 | v44.7,13.72 44.7,19.81 45.72,20.83 U4.7 | 39.12,14.22 v39.12,13.72
  Bottom 0.254: v39.12,13.72 v44.7,13.72
RAW_PR
  Top 0.254: 43.26,38.18 45.62,35.81 JP1.P$2 | 43.26,38.18 34.34,47.09 34.34,56.24 D1.A | 43.26,38.18 45.47,40.39 SJ1.1 | 43.18,38.1 43.26,38.18
RED_LED
  Top 0.254: R9.1 56.9,27.43 55.37,25.91 55.37,22.86 52.32,19.81 49.28,19.81 48.77,20.32 U4.9
RST_MCU  (via drill 0.61)
  Top 0.254: v52.83,18.29 53.34,18.8 54.86,18.8 R15.1 | v43.18,28.96 43.69,28.96 44.2,28.45 U4.29 | v37.08,22.35 36.58,22.35 35.05,20.83 35.05,14.73 JP3.3 | v44.2,6.1 v48.77,6.1
  Bottom 0.254: v52.83,18.29 52.83,4.06 50.29,1.52 ICSP2.5 49.78,1.52 49.78,2.54 48.77,3.56 v48.77,6.1 | v43.18,28.96 37.08,22.86 v37.08,22.35 | v44.2,6.1 39.12,6.1 33.02,12.19 JP3.3
RST_WIFI  (via drill 0.61)
  Top 0.254: v25.91,18.29 22.86,18.29 U5.13
  Bottom 0.254: v25.91,18.29 28.96,15.24 28.96,14.48 30.48,12.95 JP2.3
RX_MCU  (via drill 0.61)
  Top 0.254: v44.7,26.42 43.69,27.43 U4.30
  Bottom 0.254: v44.7,26.42 42.67,26.42 37.08,20.83 35.05,20.83 34.54,20.32 34.54,19.3 JP3.5
RX_WIFI  (via drill 0.61)
  Top 0.254: v13.72,7.62 10.67,4.57 6.1,4.57 U5.46
  Bottom 0.254: v13.72,7.62 25.91,19.81 28.96,19.81 30.48,18.29 JP2.5
SCK  (via drill 0.61)
  Top 0.254: v53.34,28.96 53.34,26.92 52.83,26.42 U4.17 | v36.07,7.62 v37.59,9.14 | v41.15,2.54 46.23,2.54 47.24,1.52 ICSP2.3
  Bottom 0.254: v53.34,28.96 49.78,28.96 45.21,24.38 45.21,21.34 47.24,19.3 47.24,13.72 42.67,9.14 v37.59,9.14 | v41.15,2.54 v36.07,7.62
TEST_RX  (via drill 0.61)
  Top 0.254: v49.28,23.37 49.28,21.84 49.78,21.34 U4.11 | v55.37,4.06 59.44,4.06 JP9.2
  Bottom 0.254: v49.28,23.37 51.31,21.34 51.31,20.83 52.83,19.3 53.34,19.3 55.37,17.27 v55.37,4.06
TEST_TX  (via drill 0.61)
  Top 0.254: v52.32,21.34 51.31,21.34 50.8,21.84 U4.12
  Bottom 0.254: v52.32,21.34 55.88,17.78 55.88,5.08 JP9.1
TX_MCU
  Top 0.254: JP3.4 34.54,16.76 34.54,21.34 41.15,27.94 42.16,27.94 43.18,26.92 U4.31
TX_WIFI  (via drill 0.61)
  Top 0.254: v10.67,6.1 6.1,6.1 U5.45 | JP2.4 v27.43,15.24
  Bottom 0.254: v10.67,6.1 18.29,6.1 v27.43,15.24
XTAL1  (via drill 0.61)
  Top 0.254: 43.18,7.62 43.18,10.16 Q1.1 | 43.18,7.62 43.18,6.6 C9.2 | 38.61,18.29 38.61,17.27 v38.1,16.76 | 38.61,18.29 38.61,20.32 R8.1 | 43.18,7.62 v38.1,12.7 | v45.72,19.3 46.74,20.32 U4.8 | 38.61,18.29 v42.16,21.84
  Bottom 0.254: v38.1,12.7 v38.1,16.76 | v45.72,19.3 44.7,19.3 v42.16,21.84
ZCR_DC
  Top 0.254: R1.2 5.93,52.07 U1.5 2.98,48.26 JP5.3
ZCR_MCU  (via drill 0.61)
  Top 0.254: v36.07,19.3 36.07,20.83 36.58,21.34 37.59,21.34 42.67,26.42 U4.32 | v46.23,14.22 47.24,14.22 48.77,12.7 59.44,12.7 61.98,15.24 JP4.3
  Bottom 0.254: v36.07,19.3 43.18,19.3 46.23,16.26 v46.23,14.22

### Text on the board
tPlace: SPARK | DIM | SPARK | PWR | v7 | VCC | GND | 10/3 | SPARK | WIFI | SPARK | MCU | VCC | GND | TX | RX | MISO | RST